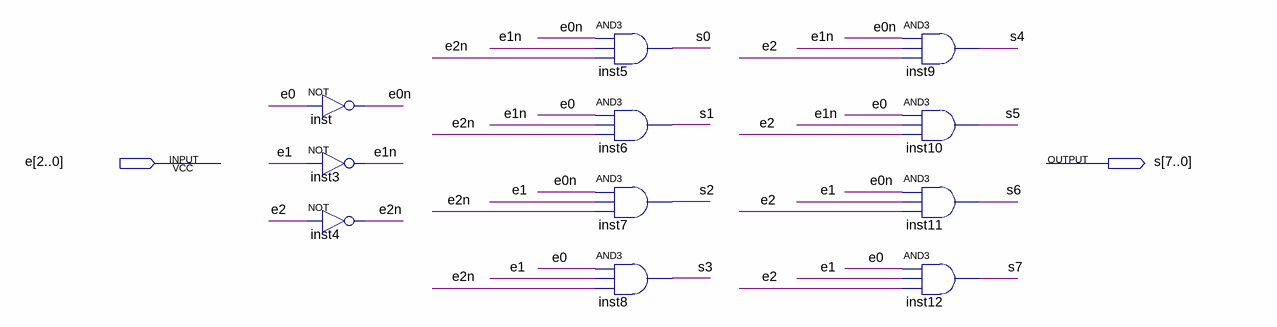
[diagram p0: schematic sheet]
// Quartus schematic ldm_decod_3x8.bdf as structural Verilog: 11 symbols, 2 pins
module ldm_decod_3x8 (
  input  [2:0] e,
  output [7:0] s
);

  wire e0n, e1n, e2n;

  not inst (e0n, e[0]);
  not inst3 (e1n, e[1]);
  not inst4 (e2n, e[2]);
  and inst5 (s[0], e0n, e1n, e2n);
  and inst6 (s[1], e[0], e1n, e2n);
  and inst7 (s[2], e0n, e[1], e2n);
  and inst8 (s[3], e[0], e[1], e2n);
  and inst9 (s[4], e0n, e1n, e[2]);
  and inst10 (s[5], e[0], e1n, e[2]);
  and inst11 (s[6], e0n, e[1], e[2]);
  and inst12 (s[7], e[0], e[1], e[2]);
endmodule
